# Altium schematic sheet PI_R3_REV1_LCD.SchDoc
size 500 x 500 mm
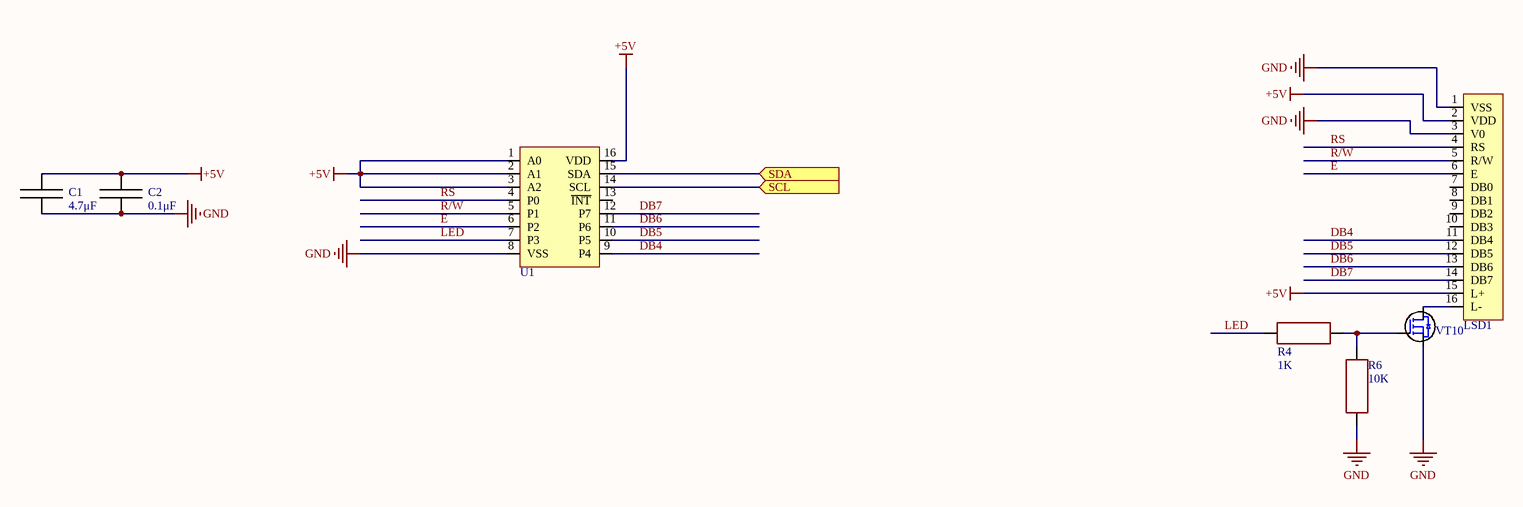
[diagram p0: PI_R3_REV1_LCD.SchDoc]

## Parts
C1  value 4.7μF  [CAP: 0402]  (hidden comment: Cap_0402)
C2  value 0.1μF  [CAP: 0402]  (hidden comment: Cap_0402)
LSD1  WH2004A  [WH2004A]  (value not drawn)
R4  value 1K  [RES: 0402]
R6  value 10K  [RES: 0402]
U1  PCF8574  [SOIC-16]  (value not drawn)
VT10  2N7002(NX7002AK)  [SOT-23-3]  (value not drawn)

## Ports
SCL (in), SDA (in)

## Nets
+5V: C1.2 C2.2 LSD1.2(VDD) LSD1.15(L+) U1.1(A0) U1.2(A1) U1.3(A2) U1.16(VDD)
GND: C1.1 C2.1 LSD1.1(VSS) LSD1.3(V0) R6.2 U1.8(VSS) VT10.3
DB4: LSD1.11(DB4) U1.9(P4)
DB5: LSD1.12(DB5) U1.10(P5)
DB6: LSD1.13(DB6) U1.11(P6)
DB7: LSD1.14(DB7) U1.12(P7)
E: LSD1.6(E) U1.6(P2)
LED: R4.1 U1.7(P3)
R/W: LSD1.5(R/W) U1.5(P1)
RS: LSD1.4(RS) U1.4(P0)
SCL: U1.14(SCL) ; port SCL
SDA: U1.15(SDA) ; port SDA
NetLSD1_16: LSD1.16(L-) VT10.2
NetR4_2: R4.2 R6.1 VT10.1

Not connected (* = marked no-connect by the designer): LSD1 7(DB0) 8(DB1) 9(DB2) 10(DB3); U1 13(~{INT})

## Library data of the parts
C1 C2 = Cap_0402: TypeDielectric: X7R(X5R); Voltage: ??V; Package/Case: 0402; Temperature: -55...+125°C(-55...+85°C); Product Category: Capacitors
LSD1 = WH2004A: LCD Character Display  20x4; Manufacturer: Winstar; Datasheet: https://www.winstar.com.tw/uploads/files/e97d4fb1a675762f600be546831f7c7f.pdf; HelpURL: https://www.winstar.com.tw/ru/products/character-lcd-display-module/wh2004a.html; Product Category: LCD
R4 R6 = Resistor_0402: Tolerance: ±5%; Product Category: Resistors; Package/Case: 0402; Temperature: -55...+125°C
U1 = PCF8574: 1 MHz, Low-Power Op Amp; Manufacturer: NXP; Datasheet: https://eu.mouser.com/datasheet/2/302/PCF8574_PCF8574A-1127673.pdf; HelpURL: https://eu.mouser.com/ProductDetail/NXP-Semiconductors/PCF8574T-3518?qs=LOCUfHb8d9srwcgHHpXqQw%3D%3D; Package/Case: SOIC-16; Product Category: I/O Expanders
VT10 = 2N7002: MOSFET N-CHANNEL 60V 115mA; Manufacturer: Fairchild; Datasheet: https://eu.mouser.com/datasheet/2/308/NDS7002A_D-1522662.pdf; HelpURL: https://eu.mouser.com/ProductDetail/onsemi-Fairchild/2N7002?qs=0dwsXDNhqlz66WJJhrTFjQ%3D%3D; Package/Case: SOT-23; Product Category: MOSFET; Analogue: NX7002AK